# Altium schematic sheet Outgoing_connectors_5_to_7.SchDoc
size A4
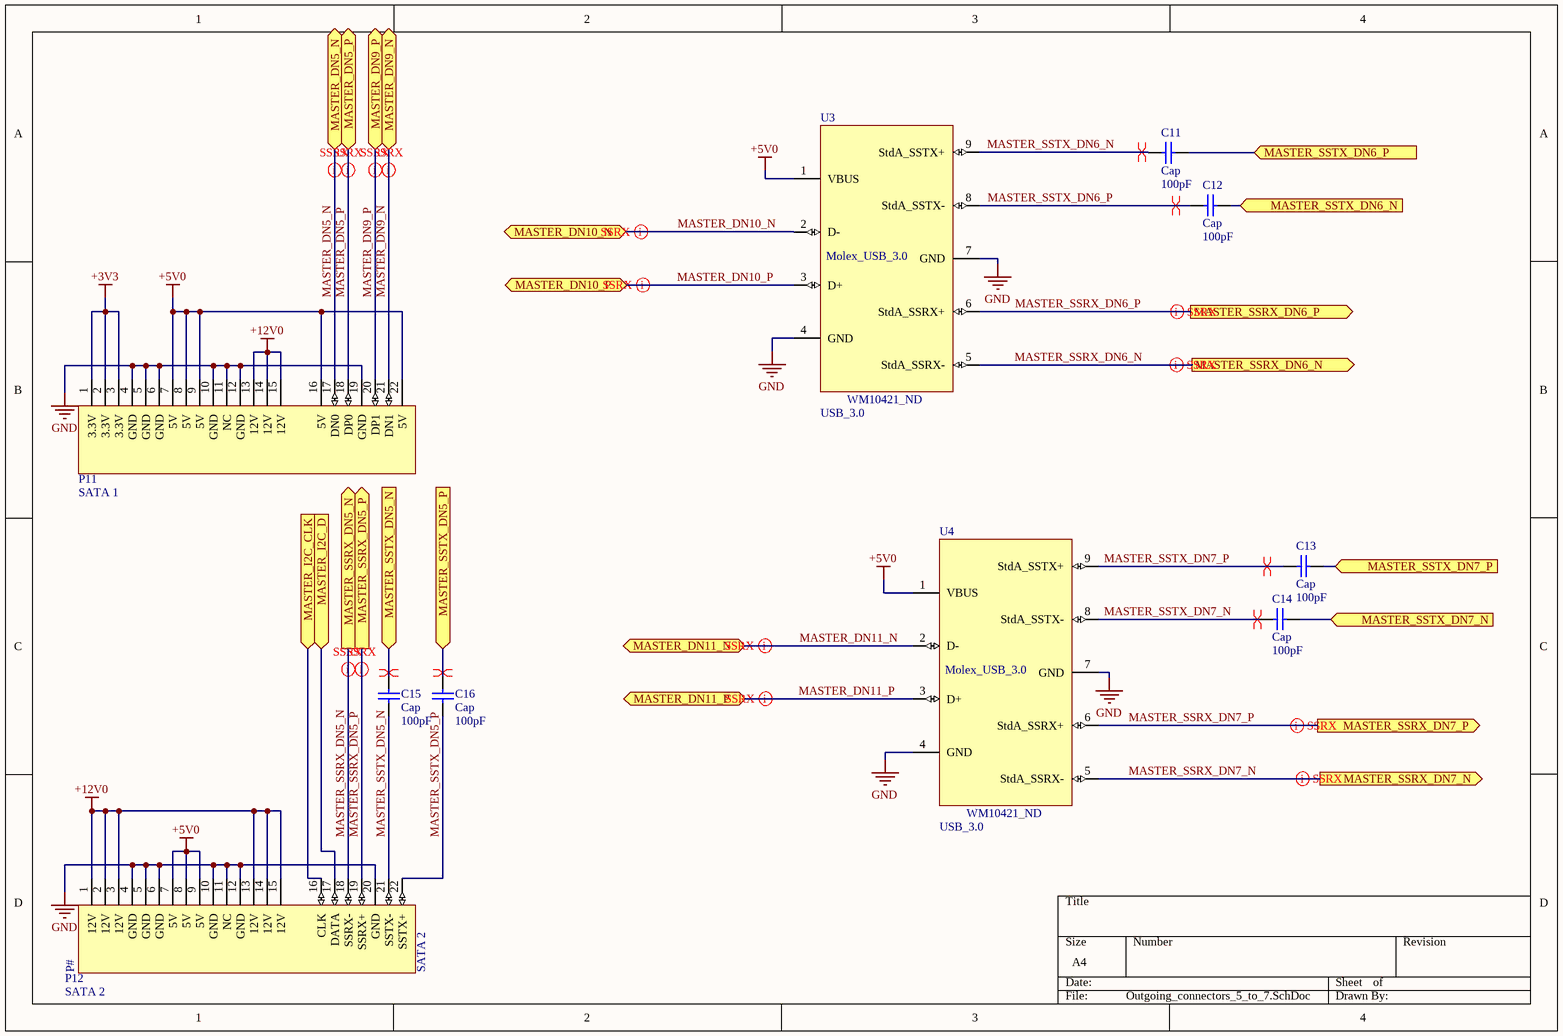
[diagram p0: Outgoing_connectors_5_to_7.SchDoc]

## Parts
C11  Cap  value 100pF  [RAD-0.3]
C12  Cap  value 100pF  [RAD-0.3]
C13  Cap  value 100pF  [RAD-0.3]
C14  Cap  value 100pF  [RAD-0.3]
C15  Cap  value 100pF  [RAD-0.3]
C16  Cap  value 100pF  [RAD-0.3]
P11  SATA 1  [Amphenol 10017660-001LF]
P12  SATA 2  [Amphenol 10017660-001LF]
U3  USB_3.0  [Molex_USB_3.0_WM10421_ND]
U4  USB_3.0  [Molex_USB_3.0_WM10421_ND]

## Ports
MASTER_DN5_N (bidir), MASTER_DN5_P (bidir), MASTER_DN9_N (bidir), MASTER_DN9_P (bidir), MASTER_DN10_N (bidir), MASTER_DN10_P (bidir), MASTER_DN11_N (bidir), MASTER_DN11_P (bidir), MASTER_I2C_CLK (in), MASTER_I2C_D (in), MASTER_SSRX_DN5_N (out), MASTER_SSRX_DN5_P (out), MASTER_SSRX_DN6_N (out), MASTER_SSRX_DN6_P (out), MASTER_SSRX_DN7_N (out), MASTER_SSRX_DN7_P (out), MASTER_SSTX_DN5_N (in), MASTER_SSTX_DN5_P (in), MASTER_SSTX_DN6_N (in), MASTER_SSTX_DN6_P (in), MASTER_SSTX_DN7_N (in), MASTER_SSTX_DN7_P (in)

## Nets
+3V3: P11.1(3.3V) P11.2(3.3V) P11.3(3.3V)
+5V0: P11.7(5V) P11.8(5V) P11.9(5V) P11.16(5V) P11.22(5V) P12.7(5V) P12.8(5V) P12.9(5V) U3.1(VBUS) U4.1(VBUS)
+12V0: P11.13(12V) P11.14(12V) P11.15(12V) P12.1(12V) P12.2(12V) P12.3(12V) P12.13(12V) P12.14(12V) P12.15(12V)
GND: P11.4(GND) P11.5(GND) P11.6(GND) P11.10(GND) P11.11(NC) P11.12(GND) P11.19(GND) P12.4(GND) P12.5(GND) P12.6(GND) P12.10(GND) P12.11(NC) P12.12(GND) P12.20(GND) U3.4(GND) U3.7(GND) U4.4(GND) U4.7(GND)
MASTER_DN5_N: P11.17(DN0) ; port MASTER_DN5_N
MASTER_DN5_P: P11.18(DP0) ; port MASTER_DN5_P
MASTER_DN9_N: P11.21(DN1) ; port MASTER_DN9_N
MASTER_DN9_P: P11.20(DP1) ; port MASTER_DN9_P
MASTER_DN10_N: U3.2(D-) ; port MASTER_DN10_N
MASTER_DN10_P: U3.3(D+) ; port MASTER_DN10_P
MASTER_DN11_N: U4.2(D-) ; port MASTER_DN11_N
MASTER_DN11_P: U4.3(D+) ; port MASTER_DN11_P
MASTER_I2C_CLK: P12.16(CLK) ; port MASTER_I2C_CLK
MASTER_I2C_D: P12.17(DATA) ; port MASTER_I2C_D
MASTER_SSRX_DN5_N: P12.18(SSRX-) ; port MASTER_SSRX_DN5_N
MASTER_SSRX_DN5_P: P12.19(SSRX+) ; port MASTER_SSRX_DN5_P
MASTER_SSRX_DN6_N: U3.5(StdA_SSRX-) ; port MASTER_SSRX_DN6_N
MASTER_SSRX_DN6_P: U3.6(StdA_SSRX+) ; port MASTER_SSRX_DN6_P
MASTER_SSRX_DN7_N: U4.5(StdA_SSRX-) ; port MASTER_SSRX_DN7_N
MASTER_SSRX_DN7_P: U4.6(StdA_SSRX+) ; port MASTER_SSRX_DN7_P
MASTER_SSTX_DN5_N: C15.1 P12.21(SSTX-)
MASTER_SSTX_DN5_N: C15.2 ; port MASTER_SSTX_DN5_N  [a separate net that carries the same name]
MASTER_SSTX_DN5_P: C16.1 P12.22(SSTX+)
MASTER_SSTX_DN5_P: C16.2 ; port MASTER_SSTX_DN5_P  [a separate net that carries the same name]
MASTER_SSTX_DN6_N: C11.2 U3.9(StdA_SSTX+)
MASTER_SSTX_DN6_N: C12.1 ; port MASTER_SSTX_DN6_N  [a separate net that carries the same name]
MASTER_SSTX_DN6_P: C11.1 ; port MASTER_SSTX_DN6_P
MASTER_SSTX_DN6_P: C12.2 U3.8(StdA_SSTX-)  [a separate net that carries the same name]
MASTER_SSTX_DN7_N: C14.1 U4.8(StdA_SSTX-)
MASTER_SSTX_DN7_N: C14.2 ; port MASTER_SSTX_DN7_N  [a separate net that carries the same name]
MASTER_SSTX_DN7_P: C13.1 U4.9(StdA_SSTX+)
MASTER_SSTX_DN7_P: C13.2 ; port MASTER_SSTX_DN7_P  [a separate net that carries the same name]

## Layout directives
differential pair; rule Signal Stimulus [Kind - Single Pulse    Level - High    Start Time = 0.000    Stop Time = 200.0p    Period Time = 400.0p]: (no net found under the mark), MASTER_DN5_N, MASTER_DN5_P, MASTER_DN9_N, MASTER_DN9_P, MASTER_DN10_N, MASTER_DN10_P, MASTER_DN11_N, MASTER_DN11_P, MASTER_SSRX_DN5_N, MASTER_SSRX_DN5_P, MASTER_SSRX_DN6_N, MASTER_SSRX_DN6_P, MASTER_SSRX_DN7_N, MASTER_SSRX_DN7_P, MASTER_SSTX_DN7_N, MASTER_SSTX_DN7_P
differential pair: MASTER_SSTX_DN6_N, MASTER_SSTX_DN6_P

## Notes on the sheet
- (in symbol Molex_USB_3.0_WM10421_ND) Molex_USB_3.0; WM10421_ND
- (in symbol SATA 2) P#

## Library data of the parts
C11-C16 = Cap: Capacitor; Published: 8-Jun-2000; LatestRevisionDate: 17-Jul-2002; LatestRevisionNote: Re-released for DXP Platform.; PackageReference: RAD-0.3; Publisher: Altium Limited; PackageDescription: Radial Cap, Thru-Hole; 2 Leads; 0.3 in Pin Spacing
P11 = SATA 1: SATA connector. / Connector 1 for option 1 as per Spec; Supplier 1: Digi-Key
P12 = SATA 2: SATA connector. / Connector 2 for option 1 as per Spec; Supplier 1: Digi-Key
U3 U4 = Molex_USB_3.0_WM10421_ND: USB 3.0 Type A Receptacle Connector 9 Position Through Hole; Manufacturer: Molex; Manufacturer Profuct #: 0484080003; Price (CAD): 1.98; ComponentLink1Description: Datasheet; ComponentLink1URL: media.digikey.com/pdf/Data%20Sheets/Molex%20PDFs/48408-001_Pkg%20Spec.pdf; ComponentLink2Description: Datasheet_Model; ComponentLink2URL: molex.com/pdm_docs/sd/484080003_sd.pdf